# Altium project RFC_MB.PrjPcb (part 7 of 7)

## Sheet DCDC_Slow.SchDoc
size 594 x 420 mm; Address1: Address1; Address2: Address2; Address3: Address3; Address4: Address4; SheetNumber: 1; Scale: 1:1; Разраб.: Иванов; Обозначение документа: АБВГ.123456.001 Э3; Пров.: Петров; Утв.: Сидоров; Наименование организации: ОАО "Концерн "МПО-Гидроприбор"; Перв. применение: АБВГ.123456.000; Наименование изделия 1: Плата; Наименование изделия 2: Схема электрическая; Наименование изделия 3: принципиальная; Нач. отд.: Нач. отд.; Фамилия нач. отд.: Сидоров
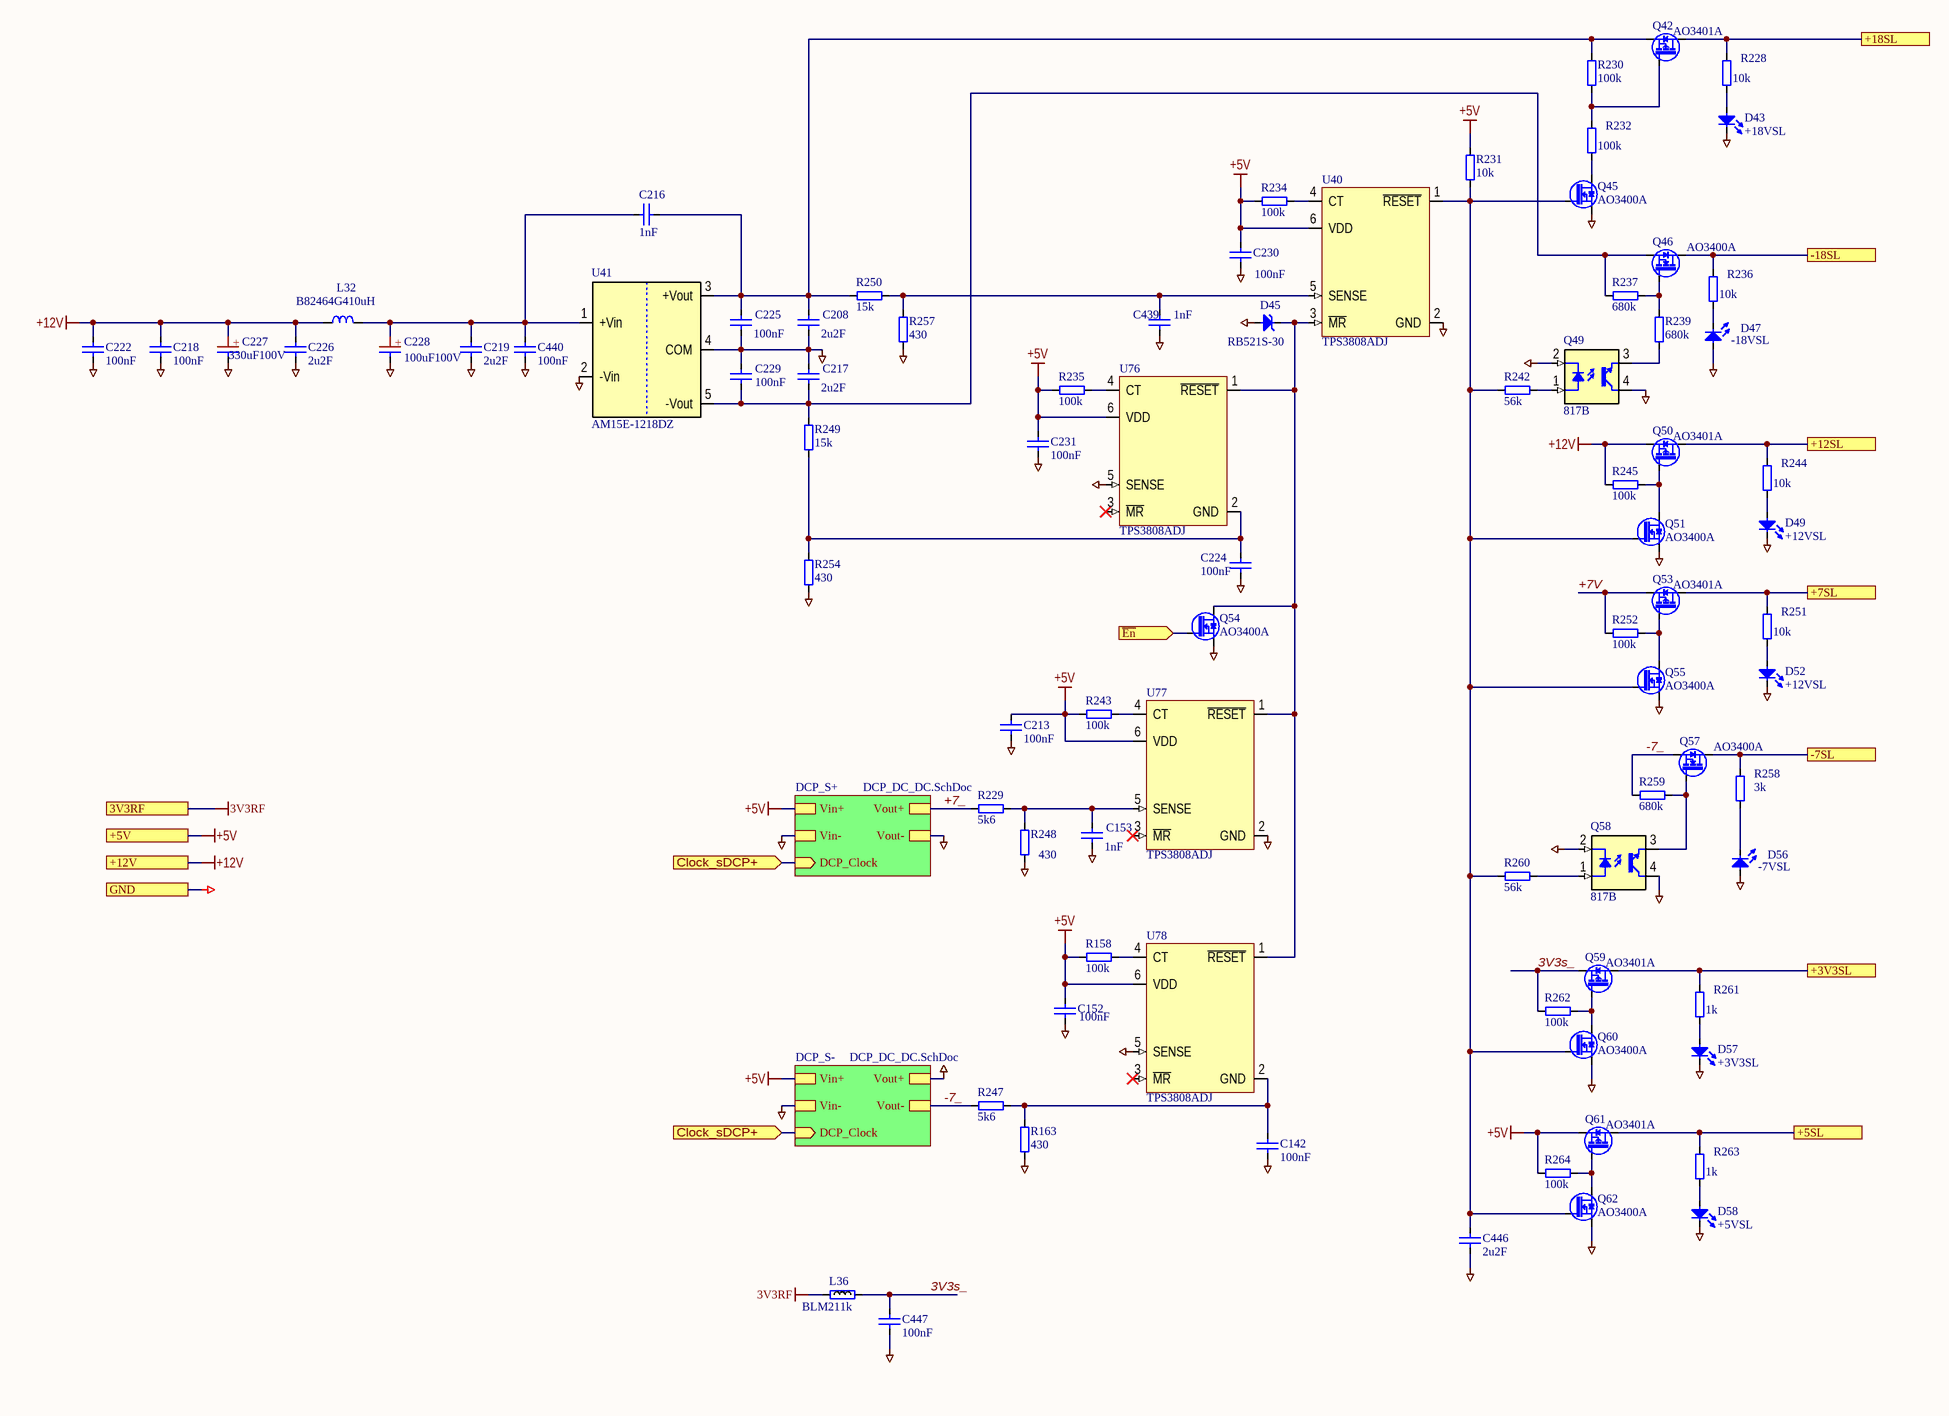
[diagram p22: DCDC_Slow.SchDoc]

### Parts
C142  100nF  [SMD0805CAP]
C152  100nF  [SMD0805CAP]
C153  1nF  [SMD0805CAP]
C208  2u2F  [SMD0805CAP]
C213  100nF  [SMD0805CAP]
C216  1nF  [SMD0805CAP]
C217  2u2F  [SMD0805CAP]
C218  100nF  [SMD0805CAP]
C219  2u2F  [SMD0805CAP]
C222  100nF  [SMD0805CAP]
C224  100nF  [SMD0805CAP]
C225  100nF  [SMD0805CAP]
C226  2u2F  [SMD0805CAP]
C227  330uF100V  [CAPPR750-1600X2000]
C228  100uF100V  [CAPPR500-1000X1250]
C229  100nF  [SMD0805CAP]
C230  100nF  [SMD0805CAP]
C231  100nF  [SMD0805CAP]
C439  1nF  [SMD0805CAP]
C440  100nF  [SMD0805CAP]
C446  2u2F  [SMD0805CAP]
C447  100nF  [SMD0805CAP]
D43  +18VSL  [LED0603]
D45  RB521S-30  [SODFL1608X65N]
D47  -18VSL  [LED0603]
D49  +12VSL  [LED0603]
D52  +12VSL  [LED0603]
D56  -7VSL  [LED0603]
D57  +3V3SL  [LED0603]
D58  +5VSL  [LED0603]
L32  B82464G410uH  [IND_COILCRAFT_MSS1038]
L36  BLM211k  [RESC2012X50N]
Q42  AO3401A  [SOT95P229X119-3N]
Q45  AO3400A  [SOT95P229X119-3N]
Q46  AO3400A  [SOT95P229X119-3N]
Q49  817B  [DIP4-300]
Q50  AO3401A  [SOT95P229X119-3N]
Q51  AO3400A  [SOT95P229X119-3N]
Q53  AO3401A  [SOT95P229X119-3N]
Q54  AO3400A  [SOT95P229X119-3N]
Q55  AO3400A  [SOT95P229X119-3N]
Q57  AO3400A  [SOT95P229X119-3N]
Q58  817B  [DIP4-300]
Q59  AO3401A  [SOT95P229X119-3N]
Q60  AO3400A  [SOT95P229X119-3N]
Q61  AO3401A  [SOT95P229X119-3N]
Q62  AO3400A  [SOT95P229X119-3N]
R158  100k  [SMD0805RES]
R163  430  [SMD0805RES]
R228  10k  [SMD0805RES]
R229  5k6  [SMD0805RES]
R230  100k  [SMD0805RES]
R231  10k  [SMD0805RES]
R232  100k  [SMD0805RES]
R234  100k  [SMD0805RES]
R235  100k  [SMD0805RES]
R236  10k  [SMD0805RES]
R237  680k  [SMD0805RES]
R239  680k  [SMD0805RES]
R242  56k  [SMD0805RES]
R243  100k  [SMD0805RES]
R244  10k  [SMD0805RES]
R245  100k  [SMD0805RES]
R247  5k6  [SMD0805RES]
R248  430  [SMD0805RES]
R249  15k  [SMD0805RES]
R250  15k  [SMD0805RES]
R251  10k  [SMD0805RES]
R252  100k  [SMD0805RES]
R254  430  [SMD0805RES]
R257  430  [SMD0805RES]
R258  3k  [SMD0805RES]
R259  680k  [SMD0805RES]
R260  56k  [SMD0805RES]
R261  1k  [SMD0805RES]
R262  100k  [SMD0805RES]
R263  1k  [SMD0805RES]
R264  100k  [SMD0805RES]
U40  TPS3808ADJ  [SOT95P270X145-6N]
U41  AM15E-1218DZ  [AM15E]
U76  TPS3808ADJ  [SOT95P270X145-6N]
U77  TPS3808ADJ  [SOT95P270X145-6N]
U78  TPS3808ADJ  [SOT95P270X145-6N]

### Sub-sheets
DCP_S+ = DCP_DC_DC.SchDoc: DCP_Clock (in), Vout+, Vout-, Vin-, Vin+
DCP_S- = DCP_DC_DC.SchDoc: DCP_Clock (in), Vout+, Vout-, Vin-, Vin+

### Ports
3V3RF, +3V3SL, +5SL, +5V, +7SL, +12SL, +12V, +18SL, -7SL, -18SL, Clock_sDCP+ (in), GND, ~{En} (in)

### Nets
3V3RF: L36.2 ; port 3V3RF
+5V: C152.2 C213.2 C230.2 C231.2 Q61.2(S) R158.1 R231.1 R234.1 R235.1 R243.1 R264.2 U40.6(VDD) U76.6(VDD) U77.6(VDD) U78.6(VDD) ; port +5V, sheet DCP_S+/Vin+, sheet DCP_S-/Vin+
+12V: C218.2 C222.2 C226.2 C227.1(+) L32.1 Q50.2(S) R245.2 ; port +12V
GND: C142.2 C152.1 C153.1 C208.1 C213.1 C217.2 C218.1 C219.1 C222.1 C224.2 C225.2 C226.1 C227.2 C228.2 C229.1 C230.1 C231.1 C439.1 C440.2 C446.2 C447.1 D43.1(C) D45.2(A) D47.2(A) D49.1(C) D52.1(C) D56.2(A) D57.1(C) D58.1(C) Q45.2(S) Q49.2(C) Q49.4(C) Q51.2(S) Q54.2(S) Q55.2(S) Q58.2(C) Q58.4(C) Q60.2(S) Q62.2(S) R163.1 R248.2 R254.1 R257.1 U40.2(GND) U41.2(-Vin) U41.4(COM) U76.5(SENSE) U77.2(GND) U78.5(SENSE) ; port GND, sheet DCP_S+/Vout-, sheet DCP_S+/Vin-, sheet DCP_S-/Vout+, sheet DCP_S-/Vin-
3V3s_: C447.2 L36.1 Q59.2(S) R262.2
3V3SL: Q59.3(D) R261.2 ; port +3V3SL
+5SL: Q61.3(D) R263.2 ; port +5SL
+7_: R229.2 ; sheet DCP_S+/Vout+
+7SL: Q53.3(D) R251.2 ; port +7SL
+7V: Q53.2(S) R252.2
+12SL: Q50.3(D) R244.2 ; port +12SL
+18SL: Q46.3(D) R236.2 ; port -18SL
-7_: Q57.2(S) R247.1 R259.2 ; sheet DCP_S-/Vout-
-7SL: Q57.3(D) R258.2 ; port -7SL
-18SL: Q42.3(D) R228.2 ; port +18SL
~{En}: Q54.1(G) ; port ~{En}
NetC142_1: C142.1 R163.2 R247.2 U78.2(GND)
NetC153_2: C153.2 R229.1 R248.1 U77.5(SENSE)
NetC208_2: C208.2 C216.2 C225.1 Q42.2(S) R230.1 R250.2 U41.3(+Vout)
NetC216_1: C216.1 C219.2 C228.1(+) C440.1 L32.2 U41.1(+Vin)
NetC217_1: C217.1 C229.2 Q46.2(S) R237.2 R249.1 U41.5(-Vout)
NetC224_1: C224.1 R249.2 R254.2 U76.2(GND)
NetC439_2: C439.2 R250.1 R257.2 U40.5(SENSE)
NetC446_1: C446.1 Q45.1(G) Q51.1(G) Q55.1(G) Q60.1(G) Q62.1(G) R231.2 R242.1 R260.1 U40.1(~{RESET})
NetD43_2: D43.2(A) R228.1
NetD45_1: D45.1(C) Q54.3(D) U40.3(~{MR}) U76.1(~{RESET}) U77.1(~{RESET}) U78.1(~{RESET})
NetD47_1: D47.1(C) R236.1
NetD49_2: D49.2(A) R244.1
NetD52_2: D52.2(A) R251.1
NetD56_1: D56.1(C) R258.1
NetD57_2: D57.2(A) R261.1
NetD58_2: D58.2(A) R263.1
NetQ22_6_1: port Clock_sDCP+, sheet DCP_S+/DCP_Clock, sheet DCP_S-/DCP_Clock
NetQ42_1: Q42.1(G) R230.2 R232.2
NetQ45_3: Q45.3(D) R232.1
NetQ46_1: Q46.1(G) R237.1 R239.2
NetQ49_1: Q49.1(A) R242.2
NetQ49_3: Q49.3(E) R239.1
NetQ50_1: Q50.1(G) Q51.3(D) R245.1
NetQ53_1: Q53.1(G) Q55.3(D) R252.1
NetQ57_1: Q57.1(G) Q58.3(E) R259.1
NetQ58_1: Q58.1(A) R260.2
NetQ59_1: Q59.1(G) Q60.3(D) R262.1
NetQ61_1: Q61.1(G) Q62.3(D) R264.1
NetR158_2: R158.2 U78.4(CT)
NetR234_2: R234.2 U40.4(CT)
NetR235_2: R235.2 U76.4(CT)
NetR243_2: R243.2 U77.4(CT)

Not connected (* = marked no-connect by the designer): U76 3(~{MR})*; U77 3(~{MR})*; U78 3(~{MR})*

### Notes on the sheet
- Подп. и дата
- Инв. № дубл.
- Взам. инв. №
- Инв. № подл.
- Изм.
- Лист
- № докум.
- Подп.
- Дата
- Копировал
- Формат А2

### Library data of the parts
C142 C152 C153 C208 C213 C216-C219 C222 C224-C226 C229-C231 C439 C440 C446 C447 = C0805: Чип конденсатор 0805; Voltage: 25V; Vendor: Vishay; DielectricType: X5R; SMD Solders: 2; Solder Option: RM; Tolerance: 20%; Pkg: SMD0805; Device: Cap0805; Price: 2
  C142 C152 C213 C218 C222 C224 C225 C229-C231 C440 C447: Value: 100nF
  C153 C216 C439: Value: 1nF
  C208 C217 C219 C226 C446: Value: 2u2F
C227 = CAP_POL_7_5x16: Конденсатор полярный d16 p7.5мм; Voltage: 100V; Vendor: Vishay; Value: 330uF; SMD Solders: 0; Solder Option: RM; Tolerance: 20%; Pkg: 7.5x16mm; Device: Cap+; THD Solders: 2; Price: 30
C228 = CAP_POL_5x10: Конденсатор полярный d10 p5мм; Voltage: 100V; Vendor: Vishay; Value: 100uF; SMD Solders: 0; Solder Option: RM; Tolerance: 20%; Pkg: 5x10mm; Device: Cap+; THD Solders: 2; Price: 20
D43 D47 D49 D52 D56-D58 = LED0603: Чип светодиод 0603; Vendor: KB; SMD Solders: 2; Solder Option: RM; Pkg: SMD0603; Price: 10; Device: LED0603
  D43: Value: +18VSL
  D47: Value: -18VSL
  D49 D52: Value: +12VSL
  D56: Value: -7VSL
  D57: Value: +3V3SL
  D58: Value: +5VSL
D45 = RB521S-30: Чип Шоттки диод; Vendor: CTK; Voltage: 30V; SMD Solders: 2; Solder Option: RM; Pkg: SOD523; Price: 5; Device: RB521S-30; Name to order: RB521S-30
L32 = B82464G4: SMD Дроссель; Vendor: Epcos; Value: 10uH; Voltage: 2; Solder Option: RM; Tolerance: 20%; Pkg: SMD10.4x10.4mm; THD Solders: 0; Name to order: B82464G4103M; Current: 3A5; Price: 400; SMD Solders: 2; Device: B82464G4
L36 = BLM21: SMD Ferrite bead 0805; Vendor: Vishay; Value: 1k; Pkg: SMD0805; SMD Solders: 2; Solder Option: RM; Price: 10; Device: BLM21
Q42 Q50 Q53 Q59 Q61 = AO3401A: PMOS; Vendor: UMW; Pkg: SOT23; SMD Solders: 3; Solder Option: RM; THD Solders: 0; Voltage: -30V; Price: 10; Device: AO3401A; Name to order: AO3401A
Q45 Q46 Q51 Q54 Q55 Q57 Q60 Q62 = AO3400A: NMOS; Vendor: UMW; Pkg: SOT23; SMD Solders: 3; Solder Option: RM; Voltage: 30V; Price: 10; Device: AO3400A; Name to order: AO3400A
Q49 Q58 = 817B: Optotransistor; Pkg: DIP4; SMD Solders: 0; Solder Option: RM; THD Solders: 4; Vendor: UMW; Voltage: 35V; Device: 817B; Price: 10; Name to order: 817B; Current: 0
R158 R163 R228-R232 R234-R237 R239 R242-R245 R247-R252 R254 R257-R264 = R0805: Чип резистор 0805; Vendor: Vishay; SMD Solders: 2; Solder Option: RM; TC: 100ppm/C; Tolerance: 1%; Pkg: SMD0805; Pwr: 125mW; Device: Res0805; Price: 2
  R158 R230 R232 R234 R235 R243 R245 R252 R262 R264: Value: 100k
  R163 R248 R254 R257: Value: 430
  R228 R231 R236 R244 R251: Value: 10k
  R229 R247: Value: 5k6
  R237 R239 R259: Value: 680k
  R242 R260: Value: 56k
  R249 R250: Value: 15k
  R258: Value: 3k
  R261 R263: Value: 1k
U40 U76-U78 = TPS3808: Supervisory Circuit. Low-Quiescent-Current, Programmable-Delay; Vendor: Texas Instruments; Value: ADJ; Pkg: SOT23-6; SMD Solders: 6; Solder Option: RM; THD Solders: 0; Name to order: TPS3808G01DBV; Current: 6uA; thVoltage: 400mV; Price: 200; Device: TPS3808
U41 = AM15E-: Negative LDO Linear stabilizer; Vendor: Aimtec; Value: 1218DZ; Pkg: DCDC_5; SMD Solders: 0; Solder Option: RM; THD Solders: 5; Name to order: AM15-1218DZ; Price: 2000; Device: AM15E-

## Sheet Si5395_CLK_GEN.SchDoc
size 594 x 420 mm
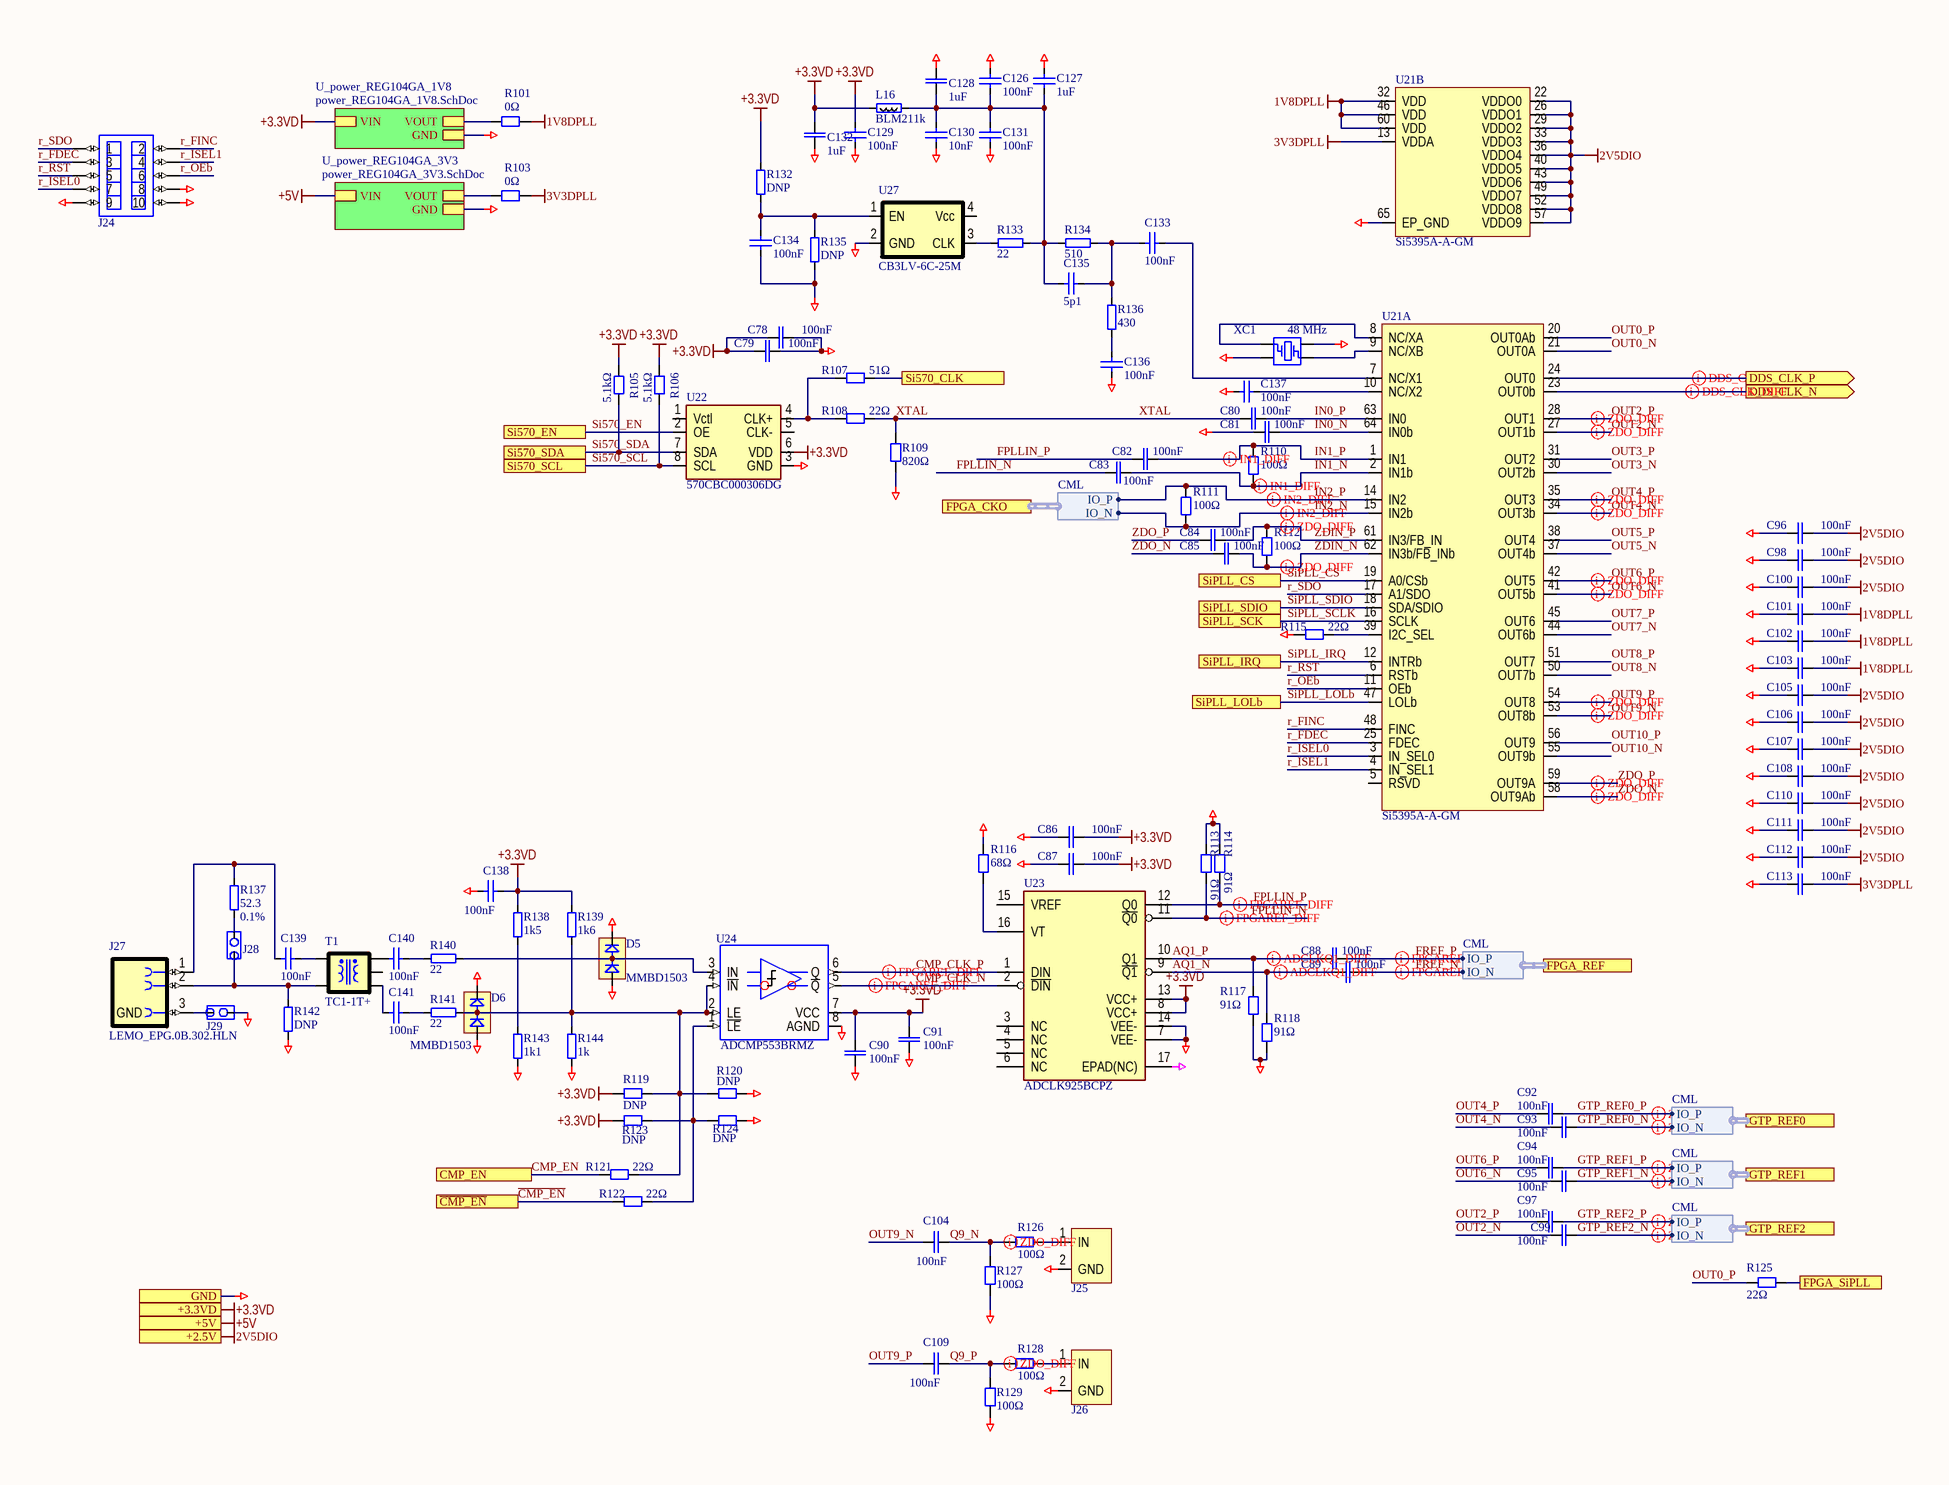
[diagram p23: Si5395_CLK_GEN.SchDoc]

### Parts
C78  100nF  [CAPC1608N]
C79  100nF  [CAPC1608N]
C80  100nF  [CAPC1608N]
C81  100nF  [CAPC1608N]
C82  100nF  [CAPC1608N]
C83  100nF  [CAPC1608N]
C84  100nF  [CAPC1608N]
C85  100nF  [CAPC1608N]
C86  100nF  [CAPC1608N]
C87  100nF  [CAPC1608N]
C88  100nF  [CAPC1608N]
C89  100nF  [CAPC1608N]
C90  100nF  [CAPC1608N]
C91  100nF  [CAPC1608N]
C92  100nF  [CAPC1608N]
C93  100nF  [CAPC1608N]
C94  100nF  [CAPC1608N]
C95  100nF  [CAPC1608N]
C96  100nF  [CAPC1608N]
C97  100nF  [CAPC1608N]
C98  100nF  [CAPC1608N]
C99  100nF  [CAPC1608N]
C100  100nF  [CAPC1608N]
C101  100nF  [CAPC1608N]
C102  100nF  [CAPC1608N]
C103  100nF  [CAPC1608N]
C104  100nF  [CAPC1608N]
C105  100nF  [CAPC1608N]
C106  100nF  [CAPC1608N]
C107  100nF  [CAPC1608N]
C108  100nF  [CAPC1608N]
C109  100nF  [CAPC1608N]
C110  100nF  [CAPC1608N]
C111  100nF  [CAPC1608N]
C112  100nF  [CAPC1608N]
C113  100nF  [CAPC1608N]
C126  100nF  [SMD0805CAP]
C127  1uF  [SMD0805CAP]
C128  1uF  [0508]
C129  100nF  [CAPC1608X87N]
C130  10nF  [CAPC1608X87N]
C131  100nF  [CAPC1608X87N]
C132  1uF  [0508]
C133  100nF  [CAPC1608X87N]
C134  100nF  [CAPC1608X87N]
C135  5p1  [CAPC1608X87N]
C136  100nF  [CAPC1608X87N]
C137  100nF  [CAPC1608X87N]
C138  100nF  [SMD0805CAP]
C139  100nF  [SMD0805CAP]
C140  100nF  [SMD0805CAP]
C141  100nF  [SMD0805CAP]
D5  MMBD1503  [SOT95P280X115-3N]
D6  MMBD1503  [SOT95P280X115-3N]
J24  DNP  [PLD-10]  (value not drawn)
J25  DNP  [LEMO_EPA.00.250.NTN]  (value not drawn)
J26  DNP  [LEMO_EPA.00.250.NTN]  (value not drawn)
J27  LEMO_EPG.0B.302.HLN  [LEMO_EPG.0B.302.HLN]
J28  PLS-2  [PLS-2]  (value not drawn)
J29  PLS-2  [PLS-2]  (value not drawn)
L16  BLM211k  [RESC2012X50N]
R101  0Ω  [RESC2012N]
R103  0Ω  [RESC2012N]
R105  5.1kΩ  [RESC2012N]
R106  5.1kΩ  [RESC2012N]
R107  51Ω  [RESC2012N]
R108  22Ω  [RESC1608N]
R109  820Ω  [RESC1608N]
R110  100Ω  [RESC1608N]
R111  100Ω  [RESC1608N]
R112  100Ω  [RESC1608N]
R113  91Ω  [RESC1608N]
R114  91Ω  [RESC1608N]
R115  22Ω  [RESC1608N]
R116  68Ω  [RESC1608N]
R117  91Ω  [RESC1608N]
R118  91Ω  [RESC1608N]
R119  DNP  [RESC1608N]
R120  DNP  [RESC1608N]
R121  22Ω  [RESC1608N]
R122  22Ω  [RESC1608N]
R123  DNP  [RESC1608N]
R124  DNP  [RESC1608N]
R125  22Ω  [RESC1608N]
R126  100Ω  [RESC1608N]
R127  100Ω  [RESC1608N]
R128  100Ω  [RESC1608N]
R129  100Ω  [RESC1608N]
R132  DNP  [SMD0805RES]
R133  22  [SMD0805RES]
R134  510  [SMD0805RES]
R135  DNP  [SMD0805RES]
R136  430  [SMD0805RES]
R137  52.3  Tolerance: 0.1%  [SMD0805RES]
R138  1k5  [SMD0805RES]
R139  1k6  [SMD0805RES]
R140  22  [SMD0805RES]
R141  22  [SMD0805RES]
R142  DNP  [SMD0805RES]
R143  1k1  [SMD0805RES]
R144  1k  [SMD0805RES]
T1  TC1-1T+  [XFMR_MINI-CIRCUITS_AT224]
U21  Si5395A-A-GM  [QFN50P900X900X100-65N-S530]  (parts A,B of 2)
U22  570CBC000306DG  [FP-57x-MFG]
U23  ADCLK925BCPZ  [QFN50P300X300X100-17N-S150]
U24  ADCMP553BRMZ  [SOP65P490X110-8N]
U27  CB3LV-6C-25M  [OSCSC508P500X700X160-4N]
XC1  value 48 MHz  [SMD3225_4PIN_XTAL]  (hidden comment: CX3225SB48000D0WPSC1)

### Sub-sheets
U_power_REG104GA_1V8 = power_REG104GA_1V8.SchDoc: GND, VOUT, VIN
U_power_REG104GA_3V3 = power_REG104GA_3V3.SchDoc: GND, VOUT, VIN

### Ports
+2.5V, +3.3VD, +5V, CMP_EN, DDS_CLK_N (out), DDS_CLK_P (out), FPGA_CKO (harness CML), FPGA_REF (harness CML), FPGA_SiPLL, GND, GTP_REF0 (harness CML), GTP_REF1 (harness CML), GTP_REF2 (harness CML), Si570_CLK, Si570_EN, Si570_SCL, Si570_SDA, SiPLL_CS, SiPLL_IRQ, SiPLL_LOLb, SiPLL_SCK, SiPLL_SDIO, ~{CMP_EN}

### Harnesses
CML: IO_N, IO_P

### Nets
1V8DPLL: C101.2 C102.2 C103.2 R101.1 U21.32(VDD) U21.46(VDD) U21.60(VDD)
2V5DIO: C96.2 C98.2 C100.2 C105.2 C106.2 C107.2 C108.2 C110.2 C111.2 C112.2 U21.22(VDDO0) U21.26(VDDO1) U21.29(VDDO2) U21.33(VDDO3) U21.36(VDDO4) U21.40(VDDO5) U21.43(VDDO6) U21.49(VDDO7) U21.52(VDDO8) U21.57(VDDO9) ; port +2.5V  [project net +2V5MOD]
3V3DPLL: C113.2 R103.1 U21.13(VDDA)
+3.3VD: C78.1 C79.1 C86.2 C87.2 C90.1 C91.1 C129.2 C132.1 C138.1 L16.1 R105.1 R106.1 R119.1 R123.1 R132.2 R138.2 R139.2 U22.6(VDD) U23.8(VCC+) U23.13(VCC+) U24.7(VCC) ; port +3.3VD, sheet U_power_REG104GA_1V8/VIN
+5V: port +5V, sheet U_power_REG104GA_3V3/VIN  [project net +5VME]
GEPAD: U23.17(EPAD(NC))
GND: C78.2 C79.2 C81.1 C86.1 C87.1 C90.2 C91.2 C96.1 C98.1 C100.1 C101.1 C102.1 C103.1 C105.1 C106.1 C107.1 C108.1 C110.1 C111.1 C112.1 C113.1 C126.1 C127.1 C128.2 C129.1 C130.1 C131.1 C132.2 C134.1 C136.1 C137.2 C138.2 D5.1 D5.2 D6.1 D6.2 J24.8 J24.9 J24.10 J25.2(GND) J26.2(GND) J29.2 R109.2 R113.2 R114.2 R115.1 R116.2 R117.1 R118.1 R120.2 R124.2 R127.1 R129.1 R135.1 R142.1 R143.1 R144.1 U21.65(EP_GND) U22.3(GND) U23.7(VEE-) U23.14(VEE-) U24.8(AGND) U27.2(GND) XC1.2(SLD) XC1.4(SLD) ; port GND, sheet U_power_REG104GA_1V8/GND, sheet U_power_REG104GA_3V3/GND
AQ1_N: C89.1 R118.2 U23.9(~{Q1})
AQ1_P: C88.1 R117.2 U23.10(Q1)
~{CMP_EN}: R122.1 ; port ~{CMP_EN}  [project net IO_AL9]
CMP_CLK_N: U23.2(~{DIN}) U24.5(~{Q})
CMP_CLK_P: U23.1(DIN) U24.6(Q)
CMP_EN: R121.1 ; port CMP_EN  [project net IO_AL10]
DDS_CLK_N: U21.23(OUT0b) ; port DDS_CLK_N
DDS_CLK_P: U21.24(OUT0) ; port DDS_CLK_P
FPLLIN_N: C83.1 R113.1 U23.11(~{Q0})
FPLLIN_P: C82.1 R114.1 U23.12(Q0)
FREF_N: C89.2 ; port FPGA_REF.IO_N  [project net IO_CR34]
FREF_P: C88.2 ; port FPGA_REF.IO_P  [project net IO_CR33]
GTP_REF0_N: C93.2 ; port GTP_REF0.IO_N  [project net GTP_REF0.IO_N]
GTP_REF0_P: C92.2 ; port GTP_REF0.IO_P  [project net GTP_REF0.IO_P]
GTP_REF1_N: C95.2 ; port GTP_REF1.IO_N  [project net GTP_REF1.IO_N]
GTP_REF1_P: C94.2 ; port GTP_REF1.IO_P  [project net GTP_REF1.IO_P]
GTP_REF2_N: C99.2 ; port GTP_REF2.IO_N  [project net GTP_REF2.IO_N]
GTP_REF2_P: C97.2 ; port GTP_REF2.IO_P  [project net GTP_REF2.IO_P]
IN0_N: C81.2 U21.64(IN0b)
IN0_P: C80.2 U21.63(IN0)
IN1_N: C83.2 R110.1 U21.2(IN1b)
IN1_P: C82.2 R110.2 U21.1(IN1)
IN2_N: R111.1 U21.15(IN2b) ; port FPGA_CKO.IO_N
IN2_P: R111.2 U21.14(IN2) ; port FPGA_CKO.IO_P
IO_AR11: R125.2 ; port FPGA_SiPLL
IO_CLK4P_AL25: R107.2 ; port Si570_CLK
OUT0_N: U21.21(OUT0A)
OUT0_P: R125.1 U21.20(OUT0Ab)
OUT2_N: C99.1 U21.27(OUT1b)
OUT2_P: C97.1 U21.28(OUT1)
OUT3_N: U21.30(OUT2b)
OUT3_P: U21.31(OUT2)
OUT4_N: C93.1 U21.34(OUT3b)
OUT4_P: C92.1 U21.35(OUT3)
OUT5_N: U21.37(OUT4b)
OUT5_P: U21.38(OUT4)
OUT6_N: C95.1 U21.41(OUT5b)
OUT6_P: C94.1 U21.42(OUT5)
OUT7_N: U21.44(OUT6b)
OUT7_P: U21.45(OUT6)
OUT8_N: U21.50(OUT7b)
OUT8_P: U21.51(OUT7)
OUT9_N: C104.1 U21.53(OUT8b)
OUT9_P: C109.1 U21.54(OUT8)
OUT10_N: U21.55(OUT9b)
OUT10_P: U21.56(OUT9)
Q9_N: C104.2 R126.1 R127.2
Q9_P: C109.2 R128.1 R129.2
r_FDEC: J24.3 U21.25(FDEC)
r_FINC: J24.2 U21.48(FINC)
r_ISEL0: J24.7 U21.3(IN_SEL0)
r_ISEL1: J24.4 U21.4(IN_SEL1)
r_OEb: J24.6 U21.11(OEb)
r_RST: J24.5 U21.6(RSTb)
r_SDO: J24.1 U21.17(A1/SDO)
Si570_EN: U22.2(OE) ; port Si570_EN  [project net IO_AL8]
Si570_SCL: R106.2 U22.8(SCL) ; port Si570_SCL  [project net IO_AL7]
Si570_SDA: R105.2 U22.7(SDA) ; port Si570_SDA  [project net IO_AL5]
SiPLL_CS: U21.19(A0/CSb) ; port SiPLL_CS  [project net IO_AL4]
SiPLL_IRQ: U21.12(INTRb) ; port SiPLL_IRQ  [project net IO_AL1]
SiPLL_LOLb: U21.47(LOLb) ; port SiPLL_LOLb  [project net IO_AL6]
SiPLL_SCLK: U21.16(SCLK) ; port SiPLL_SCK  [project net IO_AL3]
SiPLL_SDIO: U21.18(SDA/SDIO) ; port SiPLL_SDIO  [project net IO_AL2]
XTAL: C80.1 R108.2 R109.1
ZDIN_N: C85.2 R112.1 U21.62(IN3b/FB_INb)
ZDIN_P: C84.2 R112.2 U21.61(IN3/FB_IN)
ZDO_N: C85.1 U21.58(OUT9Ab)
ZDO_P: C84.1 U21.59(OUT9A)
NetC114_1: R103.2 ; sheet U_power_REG104GA_3V3/VOUT
NetC120_1: R101.2 ; sheet U_power_REG104GA_1V8/VOUT
NetC126_2: C126.2 C127.2 C128.1 C130.2 C131.2 C135.2 L16.2 R133.1 R134.2
NetC133_1: C133.1 U21.7(NC/X1)
NetC133_2: C133.2 C135.1 R134.1 R136.1
NetC134_2: C134.2 R132.1 R135.2 U27.1(EN)
NetC136_2: C136.2 R136.2
NetC137_1: C137.1 U21.10(NC/X2)
NetC139_1: C139.1 J27.1 R137.2
NetC139_2: C139.2 T1.4
NetC140_1: C140.1 T1.3
NetC140_2: C140.2 R140.2
NetC141_1: C141.1 T1.1
NetC141_2: C141.2 R141.2
NetD5_3: D5.3 R140.1 U24.3(IN)
NetD6_3: D6.3 R119.2 R120.1 R121.2 R139.1 R141.1 R144.2 U24.2(LE) U24.4(~{IN})
NetJ25_1: J25.1(IN) R126.2
NetJ26_1: J26.1(IN) R128.2
NetJ27_2: J27.2 J28.1 R142.2 T1.6
NetJ27_3: J27.3(GND) J29.1
NetJ28_2: J28.2 R137.1
NetR107_1: R107.1 R108.1 U22.4(CLK+)
NetR115_2: R115.2 U21.39(I2C_SEL)
NetR116_1: R116.1 U23.16(VT)
NetR122_2: R122.2 R123.2 R124.1 U24.1(~{LE})
NetR133_2: R133.2 U27.3(CLK)
NetR138_1: R138.1 R143.2
NetU21_8: U21.8(NC/XA) XC1.1(XTAL+)
NetU21_9: U21.9(NC/XB) XC1.3(XTAL-)

Not connected (* = marked no-connect by the designer): T1 2; U21 5(RSVD); U22 1(Vctl) 5(CLK-); U23 3(NC) 4(NC) 5(NC) 6(NC) 15(VREF); U27 4(Vcc)

### Layout directives
differential pair; rule Differential Pairs Routing [Pref Gap = 0.175mm    Min Gap  = 0.075mm    Max Gap  = 0.5mmPref Width = 0.15mm    Min Width  = 0.075mm    Max Width  = 0.5mm]: IN1_N, IN1_P, IN2_N, IN2_P, OUT2_N, OUT2_P, OUT4_N, OUT4_P, OUT6_N, OUT6_P, OUT9_N, OUT9_P, Q9_N, Q9_P, ZDIN_N, ZDIN_P, ZDO_N, ZDO_P
differential pair; rule Differential Pairs Routing [Pref Gap = 0.175mm    Min Gap  = 0.075mm    Max Gap  = 0.5mmPref Width = 0.25mm    Min Width  = 0.075mm    Max Width  = 0.5mm]: AQ1_N, AQ1_P, CMP_CLK_N, CMP_CLK_P, DDS_CLK_N, DDS_CLK_P, FPLLIN_N, FPLLIN_P, IO_CR33, IO_CR34
differential pair; rule Differential Pairs Routing [Pref Gap = 0.4mm    Min Gap  = 0.075mm    Max Gap  = 0.5mmPref Width = 0.3mm    Min Width  = 0.075mm    Max Width  = 0.5mm]: GTP_REF0.IO_N, GTP_REF0.IO_P, GTP_REF1.IO_N, GTP_REF1.IO_P, GTP_REF2.IO_N, GTP_REF2.IO_P

### Notes on the sheet
- Подп. и дата
- Инв. № дубл.
- Взам. инв. №
- Инв. № подл.
- Изм.
- Лист
- № докум.
- Подп.
- Дата
- Копировал
- Формат А2

### Library data of the parts
C78-C113 = CAPC: Generic ceramic SMD capacitor; Pkg: 0603; Maintainer: Evgeniy Kotov; SMD Solders: 2; THD Solders: 0; PartField: 100nF; Last Change Data: 06.03.2017; Release Date: 06.03.2017; Value: 100nF
C126 C127 = C0805: as C142 on sheet DCDC_Slow; Price: 2
  C126: Value: 100nF
  C127: Value: 1uF
C128 C132 = CAP_LLL219R71A105: 1uF; 10V; 0805R; X7R; Low ESL; Reverse geometry; Vendor: muRata; SolderOption: 2; THD Solders: 0; PartField: LLL219R71A105; Pkg: 0508; Value: 1uF; SMD Solders: 2; ClassName: Soldered_BINP
C129-C131 C133-C137 = C0603: Чип конденсатор 0603; Voltage: 50V; Vendor: Vishay; DielectricType: X5R; SMD Solders: 2; Solder Option: RM; Tolerance: 20%; Pkg: SMD0603; Device: Cap603; Price: 2
  C129 C131 C133 C134 C136 C137: Value: 100nF
  C130: Value: 10nF
  C135: Value: 5p1
C138-C141 = C0805: Чип конденсатор 0805; Voltage: 50V; Vendor: Vishay; DielectricType: X5R; SMD Solders: 2; Solder Option: RM; Tolerance: 20%; Pkg: SMD0805; Device: Cap0805; Value: 100nF; Price: 2
D5 D6 = MMBD1503: High Conductance Low Leakage Diode; SolderOption: 0; Pkg: SOT-3N; SMD Solders: 3; HelpURL: https://www.engineering.uiowa.edu/sites/default/files/ees/files/NI/pdfs/01/30/DS013013.pdf; Value: MMBD1503; PartField: MMBD1503; THD Solders: 0
J24 = IDC-10MS: Connector, 5x2, Male, 2.54mm Pitch, Strait contacts, with Body; PartField: IDC-10MC; SMD Solders: 0; THD Solders: 10; Maintainer: Evgeniy Kotov; Pkg: IDC-10; Last Change Data: 28.03.2017; Release Date: 28.03.2017; Value: DNP; ComponentLink1Description: Datasheet
J25 J26 = LEMO_EPA.00.250: PartField: EPA.00.250.NTN; SolderOption: 0; Pkg: LEMO 5pin; THD Solders: 5; Value: DNP; SMD Solders: 0
J27 = LEMO_EPG.0B.302.HLN: LEMO дифференциальный, угдовой; SMD Solders: 0; Solder Option: RM; THD Solders: 6; Price: 5000; Vendor: LEMO; Pkg: LEMO_EPG.0B.302.HLN; Device: LEMO_EPG.0B.302.HLN; Name to order: LEMO_EPG.0B.302.HLN
J28 J29 = PLS-2: Connector, 5x2, Male, 2.54mm Pitch, Right Angle; SMD Solders: 0; THD Solders: 2; Maintainer: Evgeniy Kotov; PartField: PLS-2; Last Change Data: 02.04.2017; Release Date: 02.04.2017; Value: PLS-2; ComponentLink1Description: Datasheet; Pkg: PLS-2
L16 = BLM21: as L36 on sheet DCDC_Slow; Price: 10; Device: BLM21
R101 R103 R105-R107 = RESC: Resistor, Generic, SMD; Pkg: 0805; Maintainer: Evgeniy Kotov; SMD Solders: 2; THD Solders: 0; Release Date: 06.03.2017; Last Change Data: 09.03.2017
  R101 R103: PartField: 0Ω; Value: 0Ω
  R105 R106: PartField: 5.1kΩ; Value: 5.1kΩ
  R107: PartField: 51Ω; Value: 51Ω
R108-R118 R121 R122 R125-R129 = RESC: Resistor, Generic, SMD; Pkg: 0603; Maintainer: Evgeniy Kotov; SMD Solders: 2; THD Solders: 0; Release Date: 06.03.2017; Last Change Data: 09.03.2017
  R108 R115 R121 R122 R125: PartField: 22Ω; Value: 22Ω
  R109: PartField: 820Ω; Value: 820Ω
  R110-R112 R126-R129: PartField: 100Ω; Value: 100Ω
  R113 R114 R117 R118: PartField: 91Ω; Value: 91Ω
  R116: PartField: 68Ω; Value: 68Ω
R119 R120 R123 R124 = RESC: Resistor, Generic, SMD; PartField: *Ω; Pkg: 0603; Maintainer: Evgeniy Kotov; SMD Solders: 2; THD Solders: 0; Release Date: 06.03.2017; Last Change Data: 09.03.2017; Value: DNP
R132 R135 R138 R139 R142-R144 = R0805: Чип резистор 0805; Vendor: Vishay; SMD Solders: 2; Solder Option: i; TC: 100ppm/C; Tolerance: 1%; Pkg: SMD0805; Pwr: 125mW; Device: Res0805; Price: 2
  R132 R135 R142: Value: DNP
  R138: Value: 1k5
  R139: Value: 1k6
  R143: Value: 1k1
  R144: Value: 1k
R133 R134 R136 R140 R141 = R0805: as R158 on sheet DCDC_Slow; Price: 2
  R133 R140 R141: Value: 22
  R134: Value: 510
  R136: Value: 430
R137 = R0805: Чип резистор 0805; Vendor: Vishay; SMD Solders: 2; Solder Option: RM; TC: 100ppm/C; Pkg: SMD0805; Pwr: 125mW; Device: Res0805; Price: 2; Value: 52.3
T1 = TC1-1T+: RF Transformer; 50Ω; 1.5 to 500 MHz; Impedance Ratio=1; Vendor: Texas Instruments; Value: 1:1; Pkg: AT1521; SMD Solders: 5; Solder Option: RM; THD Solders: 0; Price: 1000; Device: TC1-1T+; Name to order: TC1-1T+
U21 = Si5395A: Manufacturer: SiLabs; SMD Solders: 65; THD Solders: 0; Pkg: QFN-64EP; PartField: Si5395A-A-GM; Value: Si5395A; Vendor: SiLabs
U22 = Si570: XTAL OSCILLATOR SMD; Manufacturer: Silicon Labs; Manufacturer Part Number: 541AAA001040BAGR; Min Supply Voltage: 2.375V; Max Supply Voltage: 3.465V; Pkg: SMD 6pin; Frequency: 0.2-1500MHz; Nominal Supply Current: 100mA; Maintainer: Evgeniy Kotov; SMD Solders: 6; THD Solders: 0; Value: Si570; Device Class L2: Clock and Timing; ComponentLink2Description: Datasheet; RoHS: TRUE; Device Class L1: Integrated Circuits (ICs); Height: 1.33mm; Octopart: https://octopart.com/541aaa001040bagr-silicon+labs-103392146; ComponentLink2URL: https://www.silabs.com/documents/public/data-sheets/si541-datasheet.pdf; Temperature Range High: +85°C; Category: IC; Ambient Temperature Range High: +85°C; Digikey Description: XTAL OSCILLATOR SMD; Lead Free: Yes; Ambient Temperature Range Low: -40°C; Device Class L3: Timers and Oscillators; Automotive: No; Temperature: -40°C to +85°C; Temperature Range Low: -40°C; Last Change Data: 09.03.2017; PartField: 570CBC000306DG
U23 = ADCLK925BCPZ: IC CLK FANOUT BUFFER 1:2 16LFCSP; Manufacturer: Silicon Labs; Number Of Inputs: 2; Standoff Height: 0mm; Number Of Outputs: 4; Pkg: LFCSP-16EP; Max Junction Temp: +125°C; Min Supply Voltage: 1.71V; Number Of Elements: 1; Nominal Supply Current: 65mA; Max Supply Voltage: 3.63V; Logic Function: Non-Inverting; Propagation Delay: 875ps; Maintainer: Evgeniy Kotov; SMD Solders: 17; THD Solders: 0; Manufacturer Part Number: ADCLK925BCPZ; Ambient Temperature Range High: +85°C; Device Class L2: Clock and Timing; Temperature: -40°C to +85°C; Automotive: No; Height: 0.9mm; ComponentLink2URL: https://www.silabs.com/documents/public/data-sheets/si5330x-datasheet.pdf; ComponentLink2Description: Datasheet; Temperature Range High: +85°C; Category: IC; Ambient Temperature Range Low: -40°C; Device Class L1: Integrated Circuits (ICs); Octopart: https://octopart.com/si53307-b-gm-silicon+labs-51374320; Mouser Description: Clock Buffer 1:2 Univ bufr/Lvl Trans 725MHz; Temperature Range Low: -40°C; Device Class L3: Clock Buffers; Ipc Land Pattern Name: QFN50P300X300X85-16; RoHS: TRUE; Digikey Description: IC CLK BUFFER 2:4 725MHZ 16QFN; Lead Free: Yes; PartField: ADCLK925BCPZ; Last Change Data: 09.03.2017; Value: ADCLK925BCPZ
U24 = ADCMP553BRMZ: LVDS Comparator; Vendor: Analog Devices Inc; SolderOption: 0; Pkg: MSOP-8; SMD Solders: 8; Manufacturer_Part_Number: ADCMP553BRMZ; Value: ADCMP553BRMZ; PartField: ADCMP553BRMZ; THD Solders: 0
U27 = CB3LV: Clock generator; Vendor: CTS Electronic Components; Pkg: 7x5mm; SMD Solders: 4; Solder Option: RM; THD Solders: 0; Current: 60; Value: -6C-25M; Price: 1000; Device: CB3LV; Name to order: CB3LV-6C-25M
XC1 = XTAL_CX3225SB48: Kyocera XTAL 48MHz CX3225SB48000D0WPSC1; Pkg: 4 pin SMD; Maintainer: Evgeniy Kotov; SMD Solders: 4; THD Solders: 0; PartField: CX3225SB48000D0WPSC1; Vendor: Kyocera; Release Date: 06.03.2017; Last Change Data: 09.03.2017

## Sheet power_REG104GA_1V8.SchDoc
size A4
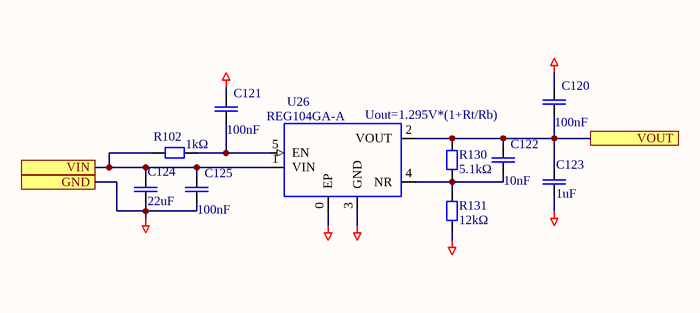
[diagram p24: power_REG104GA_1V8.SchDoc]

### Parts
C120  100nF  [CAPC1608N]
C121  100nF  [CAPC1608N]
C122  10nF  [CAPC1608N]
C123  1uF  [CAPC2012N]
C124  22uF  [CAPC2012N]
C125  100nF  [CAPC1608N]
R102  1kΩ  [RESC2012N]
R130  5.1kΩ  [RESC2012N]
R131  12kΩ  [RESC2012N]
U26  REG104GA-A  [SOT223]

### Ports
GND, VIN, VOUT

### Nets
+3.3VD: C124.2 C125.2 R102.2 U26.1(VIN) ; port VIN
GND: C120.2 C121.2 C123.1 C124.1 C125.1 R131.1 U26.0(EP) U26.3(GND) ; port GND
NetC120_1: C120.1 C122.2 C123.2 R130.2 U26.2(VOUT) ; port VOUT
NetC121_1: C121.1 R102.1 U26.5(EN)
NetC122_1: C122.1 R130.1 R131.2 U26.4(NR)

### Notes on the sheet
- (near U26) Uout=1.295V*(1+Rt/Rb)

### Library data of the parts
C120-C122 C125 = CAPC: as C78-C113 on sheet Si5395_CLK_GEN; Last Change Data: 06.03.2017; Release Date: 06.03.2017
  C120 C121 C125: PartField: 100nF; Value: 100nF
  C122: PartField: 10nF; Value: 10nF
C123 C124 = CAPC: Generic ceramic SMD capacitor; Pkg: 0805; Maintainer: Evgeniy Kotov; SMD Solders: 2; THD Solders: 0; Voltage Rating: 10V; Last Change Data: 06.03.2017; Release Date: 06.03.2017
  C123: PartField: 1uF; Value: 1uF
  C124: PartField: 22uF; Value: 22uF
R102 = RESC: Resistor, Generic, SMD; PartField: 150Ω; Pkg: 0805; Maintainer: Evgeniy Kotov; SMD Solders: 2; THD Solders: 0; Release Date: 06.03.2017; Last Change Data: 09.03.2017; Value: 1kΩ
R130 R131 = RESC: as R101 on sheet Si5395_CLK_GEN; Release Date: 06.03.2017; Last Change Data: 09.03.2017
  R130: PartField: 5.1kΩ; Value: 5.1kΩ
  R131: PartField: 12kΩ; Value: 12kΩ
U26 = REG104GA-A: Single Output LDO, 1.0A, Adj.(1.295 to 5.5V), Low Noise, Fast Transient Response; Manufacturer: Texas Instruments; Manufacturer_Part_Number: reg104-a_dcq_6; INDUSTRY_STD_PKG_TYPE: SOT-223; FAMILY_NAME: SINGLE CHANNEL LDO; PIN_COUNT: 6; PACKAGE_DESIGNATOR: DCQ; Pkg: SOT-5EP; THD Solders: 0; Value: REG104GA-A; Datasheet URL: http://www.ti.com/lit/gpn/REG104-A; GENERIC_PART_NUMBER: REG104GA-A; Vendor: Texas Instruments; SMD Solders: 6; PartField: REG104GA-A

## Sheet power_REG104GA_3V3.SchDoc
size A4
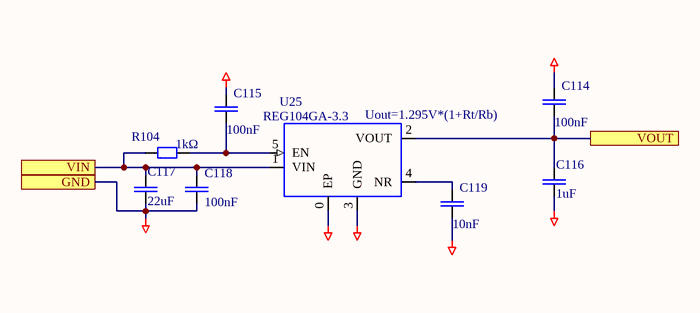
[diagram p25: power_REG104GA_3V3.SchDoc]

### Parts
C114  100nF  [CAPC1608N]
C115  100nF  [CAPC1608N]
C116  1uF  [CAPC2012N]
C117  22uF  [CAPC2012N]
C118  100nF  [CAPC1608N]
C119  10nF  [CAPC1608N]
R104  1kΩ  [RESC2012N]
U25  REG104GA-3.3  [SOT223]

### Ports
GND, VIN, VOUT

### Nets
+5VME: C117.2 C118.2 R104.2 U25.1(VIN) ; port VIN
GND: C114.2 C115.2 C116.1 C117.1 C118.1 C119.1 U25.0(EP) U25.3(GND) ; port GND
NetC114_1: C114.1 C116.2 U25.2(VOUT) ; port VOUT
NetC115_1: C115.1 R104.1 U25.5(EN)
NetC119_2: C119.2 U25.4(NR)

### Notes on the sheet
- (near U25) Uout=1.295V*(1+Rt/Rb)

### Library data of the parts
C114 C115 C118 C119 = CAPC: as C78-C113 on sheet Si5395_CLK_GEN; Last Change Data: 06.03.2017; Release Date: 06.03.2017
  C114 C115 C118: PartField: 100nF; Value: 100nF
  C119: PartField: 10nF; Value: 10nF
C116 C117 = CAPC: as C123 on sheet power_REG104GA_1V8; Last Change Data: 06.03.2017; Release Date: 06.03.2017
  C116: PartField: 1uF; Value: 1uF
  C117: PartField: 22uF; Value: 22uF
R104 = RESC: as R102 on sheet power_REG104GA_1V8; Release Date: 06.03.2017; Last Change Data: 09.03.2017; Value: 1kΩ
U25 = REG104GA-3.3: Single Output LDO, 1.0A, Fixed (3.3V), Low Noise, Fast Transient Response; Manufacturer: Texas Instruments; Manufacturer_Part_Number: reg104-33_dcq_6; INDUSTRY_STD_PKG_TYPE: SOT-223; FAMILY_NAME: SINGLE CHANNEL LDO; PIN_COUNT: 6; PACKAGE_DESIGNATOR: DCQ; Pkg: SOT-5EP; THD Solders: 0; Value: REG104GA-3.3; Datasheet URL: http://www.ti.com/lit/gpn/REG104-A; GENERIC_PART_NUMBER: REG104GA-3.3; Vendor: Texas Instruments; SMD Solders: 6; PartField: REG104GA-3.3

## Sheet Si5395_CLK_PWR.SchDoc
size A4

## Nets that join several sheets
3V3RF: RFCtl (C151.2 L80.2 R407.1 U60.14), DCDC_Hall (L25.2), Integrator (15 pins), DCDC_DDS (L21.2), DCDC_Slow (L36.2)
+1V8MOD: main (TP14.1), cyc_v_som_B (J14.B52 J14.B76 J14.B108 J14.B128)
+2V5MOD: main (TP13.1), cyc_v_som_A (J14.A53 J14.A62 J14.A65 J14.A89), cyc_v_som_B (6 pins), cyc_v_som_C (6 pins), Si5395_CLK_GEN (20 pins)
+3.3VD: main (39 pins), cyc_v_som_A (J14.A38 J14.A41 J14.A74 J14.A77), ethernet_1gbe_ext_magn (R90.1 R92.1), ethernet_dual_100mbe_ext_magn (R79.1 R85.1), uart_adm3222 (C38.2 R51.2 U10.19), jtag (7 pins), sdcard_emmc (44 pins), U_can_phy (C66_1.2 U18_1.1), U_can_phy (C66_2.2 U18_2.1), U_SFPplusConn_0 (11 pins), U_SFPplusConn_1 (11 pins), U_SFPplusConn_2 (11 pins), U_SFPplusConn_3 (11 pins), Si5395_CLK_GEN (21 pins), power_REG104GA_1V8 (C124.2 C125.2 R102.2 U26.1)
+3V3MOD: main (C15.2 TP12.1 U6.14), cyc_v_som_A (J14.A26 J14.A29 J14.A50 J14.A86), cyc_v_som_B (6 pins), cyc_v_som_C (J14.C96 J14.C103 J14.C136 J14.C143)
+5V: RFCtl (22 pins), DCDC_Hall (10 pins), RF/RF_H/H_DCDC/DCP_H- (C206_1.2 L29_1.1 R233_1.1 R241_1.1), RF/RF_i/i_DCDC/DCP_i- (C206_2.2 L29_2.1 R233_2.1 R241_2.1), RF/RF_i/i_DCDC/DCP_i+ (C206_3.2 L29_3.1 R233_3.1 R241_3.1), DCDC_DDS (7 pins), RF/RF_D/D_DCDC/DCP_D+ (C206_4.2 L29_4.1 R233_4.1 R241_4.1), RF/RF_D/D_DCDC/DCP_D- (C206_5.2 L29_5.1 R233_5.1 R241_5.1), DCDC_Slow (15 pins), RF/RF_S/S_DCDC/DCP_S+ (C206_6.2 L29_6.1 R233_6.1 R241_6.1), RF/RF_S/S_DCDC/DCP_S- (C206_7.2 L29_7.1 R233_7.1 R241_7.1)
+5VME: cyc_v_som_A (10 pins), U_can_phy (C69_1.2 C70_1.2 U19_1.1), U_can_phy (C69_2.2 C70_2.2 U19_2.1), power_REG104GA_3V3 (C117.2 C118.2 R104.2 U25.1)
+12V: DCDC_Hall (7 pins), DCDC_int (5 pins), DCDC_DDS (Q3.2 R162.2), DCDC_Slow (7 pins)
GND: main (84 pins), cyc_v_som_A (29 pins), cyc_v_som_B (37 pins), cyc_v_som_C (41 pins), ethernet_1gbe_ext_magn (7 pins), ethernet_dual_100mbe_ext_magn (7 pins), uart_adm3222 (7 pins), jtag (C33.1 J15.10 R43.2 U9.2), sdcard_emmc (33 pins), U_can_phy (5 pins), U_can_phy (5 pins), Power_3V3_LDO (C71.1 C72.1 U20.2), U_SFPplusConn_0 (31 pins), U_SFPplusConn_1 (31 pins), U_SFPplusConn_2 (31 pins), U_SFPplusConn_3 (31 pins), RFCtl (44 pins), Hall (62 pins), DCDC_Hall (41 pins), RF/RF_H/H_DCDC/DCP_H- (12 pins), Integrator (17 pins), DCDC_int (9 pins), RF/RF_i/i_DCDC/DCP_i- (9 pins), RF/RF_i/i_DCDC/DCP_i+ (9 pins), DDS (78 pins), DCDC_DDS (21 pins), RF/RF_D/D_DCDC/DCP_D+ (12 pins), RF/RF_D/D_DCDC/DCP_D- (12 pins), SlowChans (227 pins), DCDC_Slow (49 pins), RF/RF_S/S_DCDC/DCP_S+ (12 pins), RF/RF_S/S_DCDC/DCP_S- (12 pins), Si5395_CLK_GEN (65 pins), power_REG104GA_1V8 (8 pins), power_REG104GA_3V3 (8 pins)
intG: Integrator (33 pins), DCDC_int (35 pins), RF/RF_i/i_DCDC/DCP_i- (C209_2.2 C215_2.2 U38_2.13), RF/RF_i/i_DCDC/DCP_i+ (C209_3.2 C215_3.2 U38_3.13)
MGND: main (8 pins), ethernet_1gbe_ext_magn (C58.1 C59.1 J18.S1 J18.S2), ethernet_dual_100mbe_ext_magn (C51.2 C56.1 J17.S1 J17.S2), uart_adm3222 (J16.0)
VBUT: main (C7.2 R8.1), cyc_v_som_A (J14.A168)
3V3BATLDO: main (D1.1), Power_3V3_LDO (C72.2 R98.2 U20.5)
3V3DDS: DDS (25 pins), DCDC_DDS (Q10.3 R164.2)
3V3SL: SlowChans (108 pins), DCDC_Slow (Q59.3 R261.2)
12DDS: DDS (L22.2), DCDC_DDS (Q3.3 R154.2)
+3V3Hall: Hall (28 pins), DCDC_Hall (Q25.3 R193.2)
+5SL: SlowChans (L68.2 L76.2 L85.2 L93.1), DCDC_Slow (Q61.3 R263.2)
+7_: DCDC_Slow (R229.2), RF/RF_S/S_DCDC/DCP_S+ (C209_6.2 C215_6.2 U38_6.13)
+7D: DCDC_DDS (Q1.2 R147.2 R152.1), RF/RF_D/D_DCDC/DCP_D+ (C209_4.2 C215_4.2 U38_4.13)
+7DDS: DDS (L24.2), DCDC_DDS (Q1.3 R146.2)
+7H: DCDC_int (R218.2), RF/RF_i/i_DCDC/DCP_i+ (C209_3.1 C215_3.1 U38_3.12)
+7int: Integrator (L37.2), DCDC_int (Q37.3 R217.2)
+7SL: SlowChans (L71.2 L79.2 L88.2 L96.2), DCDC_Slow (Q53.3 R251.2)
+12Hall: Hall (L28.2), DCDC_Hall (Q18.3 R178.2)
+12SL: SlowChans (L69.2 L77.2 L86.2 L94.1), DCDC_Slow (Q50.3 R244.2)
+18Hall: Hall (L34.2), DCDC_Hall (Q12.3 R166.2)
+18int: Integrator (L39.2), DCDC_int (Q29.3 R199.2)
+18SL: SlowChans (L73.2 L82.2 L90.2 L98.2), DCDC_Slow (Q46.3 R236.2)
-7_: DCDC_Slow (Q57.2 R247.1 R259.2), RF/RF_S/S_DCDC/DCP_S- (C209_7.1 C215_7.1 U38_7.12)
-7D: DCDC_DDS (Q6.2 R149.1 R157.2), RF/RF_D/D_DCDC/DCP_D- (C209_5.1 C215_5.1 U38_5.12)
-7DDS: DDS (L23.2), DCDC_DDS (Q6.3 R156.2)
-7H: DCDC_Hall (Q21.2 R186.2 R187.1), RF/RF_H/H_DCDC/DCP_H- (C209_1.1 C215_1.1 U38_1.12)
-7Hall: Hall (L30.2), DCDC_Hall (Q21.3 R185.2)
-7i: DCDC_int (Q40.2 R224.2 R225.2), RF/RF_i/i_DCDC/DCP_i- (C209_2.1 C215_2.1 U38_2.12)
-7int: Integrator (L35.2), DCDC_int (Q40.3 R222.2)
-7SL: SlowChans (L70.2 L78.2 L87.2 L95.2), DCDC_Slow (Q57.3 R258.2)
-18Hall: Hall (L33.2), DCDC_Hall (Q14.3 R169.2)
-18int: Integrator (L38.2), DCDC_int (Q32.3 R208.2)
-18SL: SlowChans (L72.2 L81.2 L89.2 L97.2), DCDC_Slow (Q42.3 R228.2)
~{En}: RFCtl (U68.8 U68.13), DCDC_Hall (Q20.1), DCDC_int (R221.1), DCDC_DDS (Q5.1), DCDC_Slow (Q54.1)
BOOT_MODE0: main (J7.7), cyc_v_som_A (J14.A126)
BOOT_MODE1: main (J7.8), cyc_v_som_A (J14.A112)
CAN0_G: main (J2.3), U_can_phy (L13_1.1)
CAN0_H: main (J2.7), U_can_phy (L12_1.1)
CAN0_L: main (J2.2), U_can_phy (L12_1.4)
CAN0_RX: cyc_v_som_A (J14.A88), U_can_phy (R95_1.2)
CAN0_TX: cyc_v_som_A (J14.A90), U_can_phy (R97_1.2)
CAN1_G: main (J2.4), U_can_phy (L13_2.1)
CAN1_H: main (J2.8), U_can_phy (L12_2.1)
CAN1_L: main (J2.1), U_can_phy (L12_2.4)
CAN1_RX: cyc_v_som_A (J14.A104), U_can_phy (R95_2.2)
CAN1_TX: cyc_v_som_A (J14.A106), U_can_phy (R97_2.2)
Clock_hDCP-: RFCtl (U66.3), RF/RF_H/H_DCDC/DCP_H- (Q22_1.1 R233_1.2)
Clock_iDCP+: RFCtl (U64.3), RF/RF_i/i_DCDC/DCP_i+ (Q22_3.1 R233_3.2)
Clock_iDCP-: RFCtl (U64.6), RF/RF_i/i_DCDC/DCP_i- (Q22_2.1 R233_2.2)
DDS_CLK_N: DDS (C145.1 R174.1), Si5395_CLK_GEN (U21.23)
DDS_CLK_P: DDS (C144.1 R174.2), Si5395_CLK_GEN (U21.24)
EN_3V3: main (U6.6), RFCtl (J41.1)
ETH0_A_N: cyc_v_som_A (J14.A163), ethernet_1gbe_ext_magn (L11.3 U15.1)
ETH0_A_P: cyc_v_som_A (J14.A165), ethernet_1gbe_ext_magn (L11.2 U15.3)
ETH0_B_N: cyc_v_som_A (J14.A157), ethernet_1gbe_ext_magn (L11.6 U15.4)
ETH0_B_P: cyc_v_som_A (J14.A159), ethernet_1gbe_ext_magn (L11.5 U15.6)
ETH0_C_N: cyc_v_som_A (J14.A151), ethernet_1gbe_ext_magn (L11.9 U16.1)
ETH0_C_P: cyc_v_som_A (J14.A153), ethernet_1gbe_ext_magn (L11.8 U16.3)
ETH0_CTREF: cyc_v_som_A (J14.A155), ethernet_1gbe_ext_magn (5 pins)
ETH0_D_N: cyc_v_som_A (J14.A145), ethernet_1gbe_ext_magn (L11.12 U16.4)
ETH0_D_P: cyc_v_som_A (J14.A147), ethernet_1gbe_ext_magn (L11.11 U16.6)
ETH0_LED1: cyc_v_som_A (J14.A149), ethernet_1gbe_ext_magn (J18.9)
ETH0_LED2: cyc_v_som_A (J14.A161), ethernet_1gbe_ext_magn (J18.11)
ETH1_CTREF: cyc_v_som_A (J14.A154), ethernet_dual_100mbe_ext_magn (5 pins)
ETH1_LED1: cyc_v_som_A (J14.A160), ethernet_dual_100mbe_ext_magn (J17.9B)
ETH1_LED2: cyc_v_som_A (J14.A148), ethernet_dual_100mbe_ext_magn (J17.9A)
ETH1A_RX_N: cyc_v_som_A (J14.A156), ethernet_dual_100mbe_ext_magn (L6.6 U13.4)
ETH1A_RX_P: cyc_v_som_A (J14.A158), ethernet_dual_100mbe_ext_magn (L6.5 U13.6)
ETH1A_TX_N: cyc_v_som_A (J14.A162), ethernet_dual_100mbe_ext_magn (L6.3 U13.1)
ETH1A_TX_P: cyc_v_som_A (J14.A164), ethernet_dual_100mbe_ext_magn (L6.2 U13.3)
ETH1B_RX_N: cyc_v_som_A (J14.A144), ethernet_dual_100mbe_ext_magn (L6.12 U14.4)
ETH1B_RX_P: cyc_v_som_A (J14.A146), ethernet_dual_100mbe_ext_magn (L6.11 U14.6)
ETH1B_TX_N: cyc_v_som_A (J14.A150), ethernet_dual_100mbe_ext_magn (L6.9 U14.1)
ETH1B_TX_P: cyc_v_som_A (J14.A152), ethernet_dual_100mbe_ext_magn (L6.8 U14.3)
FCKO_N: main (C6.1), cyc_v_som_C (J14.C163)
FCKO_P: main (C5.1), cyc_v_som_C (J14.C161)
FPGA_CONFDONE: main (U6.1), cyc_v_som_A (J14.A130)
GPIO51: main (TP3.1), cyc_v_som_A (J14.A82)
GPIO52: main (TP5.1), cyc_v_som_A (J14.A84)
GPIO57: main (R22.1), cyc_v_som_A (J14.A98)
GPIO58: main (TP7.1), cyc_v_som_A (J14.A100)
GPIO63: main (TP9.1), cyc_v_som_A (J14.A92)
GPIO64: main (TP11.1), cyc_v_som_A (J14.A94)
GTP_REF0.IO_N: cyc_v_som_B (J14.B6), Si5395_CLK_GEN (C93.2)
GTP_REF0.IO_P: cyc_v_som_B (J14.B4), Si5395_CLK_GEN (C92.2)
GTP_REF1.IO_N: cyc_v_som_B (J14.B12), Si5395_CLK_GEN (C95.2)
GTP_REF1.IO_P: cyc_v_som_B (J14.B10), Si5395_CLK_GEN (C94.2)
GTP_REF2.IO_N: cyc_v_som_B (J14.B5), Si5395_CLK_GEN (C99.2)
GTP_REF2.IO_P: cyc_v_som_B (J14.B3), Si5395_CLK_GEN (C97.2)
HPS_PORn: main (R23.2 U7.1), cyc_v_som_A (J14.A132), sdcard_emmc (U11.M5)
HPS_RSTn: main (C14.1 J13.1 J13.2 R28.2), cyc_v_som_A (J14.A124), jtag (R40.1)
IN2_N: main (C6.2), Si5395_CLK_GEN (R111.1 U21.15)
IN2_P: main (C5.2), Si5395_CLK_GEN (R111.2 U21.14)
INT_SFP01: main (R5.1 U3.13), cyc_v_som_A (J14.A57)
INT_SFP23: main (R4.1 U2.13), cyc_v_som_A (J14.A55)
IO_AL1: cyc_v_som_A (J14.A15), Si5395_CLK_GEN (U21.12)
IO_AL2: cyc_v_som_A (J14.A17), Si5395_CLK_GEN (U21.18)
IO_AL3: cyc_v_som_A (J14.A19), Si5395_CLK_GEN (U21.16)
IO_AL4: cyc_v_som_A (J14.A21), Si5395_CLK_GEN (U21.19)
IO_AL5: cyc_v_som_A (J14.A25), Si5395_CLK_GEN (R105.2 U22.7)
IO_AL6: cyc_v_som_A (J14.A27), Si5395_CLK_GEN (U21.47)
IO_AL7: cyc_v_som_A (J14.A31), Si5395_CLK_GEN (R106.2 U22.8)
IO_AL8: cyc_v_som_A (J14.A33), Si5395_CLK_GEN (U22.2)
IO_AL9: cyc_v_som_A (J14.A37), Si5395_CLK_GEN (R122.1)
IO_AL10: cyc_v_som_A (J14.A39), Si5395_CLK_GEN (R121.1)
IO_AL11: main (6 pins), cyc_v_som_A (J14.A49)
IO_AL12: main (6 pins), cyc_v_som_A (J14.A51)
IO_AL15: main (R24.1), cyc_v_som_A (J14.A61)
IO_AL16: main (R21.1), cyc_v_som_A (J14.A63)
IO_AR11: cyc_v_som_A (J14.A46), Si5395_CLK_GEN (R125.2)
IO_BL1: cyc_v_som_B (J14.B7), Hall (R331.2)
IO_BL2: cyc_v_som_B (J14.B9), Hall (R332.2)
IO_BL3: cyc_v_som_B (J14.B57), Hall (R333.2)
IO_BL4: cyc_v_som_B (J14.B59), Hall (R334.2)
IO_BL5: cyc_v_som_B (J14.B75), Hall (R335.2)
IO_BL6: cyc_v_som_B (J14.B77), Hall (R336.2)
IO_BL7: cyc_v_som_B (J14.B81), Hall (R337.2)
IO_BL8: cyc_v_som_B (J14.B83), Hall (R338.2)
IO_BL9: cyc_v_som_B (J14.B87), Hall (R339.2)
IO_BL10: cyc_v_som_B (J14.B89), Hall (R370.2)
IO_BL11: cyc_v_som_B (J14.B91), Hall (R371.2)
IO_BL12: cyc_v_som_B (J14.B93), Hall (R372.2)
IO_BL13: cyc_v_som_B (J14.B97), Hall (R378.2)
IO_BL14: cyc_v_som_B (J14.B99), Hall (R379.2)
IO_BL15: cyc_v_som_B (J14.B101), Hall (R380.2)
IO_BL16: cyc_v_som_B (J14.B103), Hall (R381.2)
IO_BL17: cyc_v_som_B (J14.B107), Integrator (R419.1)
IO_BL18: cyc_v_som_B (J14.B109), Integrator (R420.1)
IO_BL19: cyc_v_som_B (J14.B111), Integrator (R421.1)
IO_BL20: cyc_v_som_B (J14.B113), Integrator (R422.1)
IO_BL21: cyc_v_som_B (J14.B117), Integrator (R423.1)
IO_BL22: cyc_v_som_B (J14.B119), Integrator (R424.1)
IO_BL23: cyc_v_som_B (J14.B123), Integrator (R425.1)
IO_BL24: cyc_v_som_B (J14.B125), Integrator (R426.1)
IO_BL25: cyc_v_som_B (J14.B129), Integrator (R427.1)
IO_BL26: cyc_v_som_B (J14.B131), Integrator (R428.1)
IO_BL27: cyc_v_som_B (J14.B133), Integrator (R429.1)
IO_BL28: cyc_v_som_B (J14.B135), Integrator (R430.1)
IO_BL29: cyc_v_som_B (J14.B139), Integrator (R431.1)
IO_BL30: cyc_v_som_B (J14.B141), Integrator (R432.1)
IO_BL31: cyc_v_som_B (J14.B145), Integrator (R433.1)
IO_BL32: cyc_v_som_B (J14.B147), Integrator (R434.1)
IO_BL33: cyc_v_som_B (J14.B151), Integrator (R436.1)
IO_BL34: cyc_v_som_B (J14.B153), Integrator (R439.1)
IO_BL35: cyc_v_som_B (J14.B157), Integrator (R440.1)
IO_BL36: cyc_v_som_B (J14.B159), Integrator (R528.1)
IO_BR23: cyc_v_som_B (J14.B130), SlowChans (R153.2)
IO_BR24: cyc_v_som_B (J14.B132), SlowChans (R209.2)
IO_BR25: cyc_v_som_B (J14.B136), SlowChans (R256.2)
IO_BR26: cyc_v_som_B (J14.B138), SlowChans (R445.2)
IO_BR27: cyc_v_som_B (J14.B142), SlowChans (R182.2)
IO_BR28: cyc_v_som_B (J14.B144), SlowChans (R220.2)
IO_BR29: cyc_v_som_B (J14.B148), SlowChans (R437.2)
IO_BR30: cyc_v_som_B (J14.B150), SlowChans (R446.2)
IO_BR31: cyc_v_som_B (J14.B154), SlowChans (R183.2)
IO_BR32: cyc_v_som_B (J14.B156), SlowChans (R238.2)
IO_BR33: cyc_v_som_B (J14.B160), SlowChans (R438.2)
IO_BR34: cyc_v_som_B (J14.B162), SlowChans (R447.2)
IO_BR35: cyc_v_som_B (J14.B164), SlowChans (R456.2)
IO_BR36: cyc_v_som_B (J14.B166), SlowChans (R461.2)
IO_CL1: cyc_v_som_C (J14.C63), SlowChans (R517.2)
IO_CL2: cyc_v_som_C (J14.C65), SlowChans (R521.2)
IO_CL3: cyc_v_som_C (J14.C69), SlowChans (R351.2)
IO_CL4: cyc_v_som_C (J14.C71), SlowChans (R356.2)
IO_CL5: cyc_v_som_C (J14.C75), SlowChans (R361.2)
IO_CL6: cyc_v_som_C (J14.C77), SlowChans (R366.2)
IO_CL7: cyc_v_som_C (J14.C79), SlowChans (R352.2)
IO_CL8: cyc_v_som_C (J14.C81), SlowChans (R357.2)
IO_CL9: cyc_v_som_C (J14.C85), SlowChans (R362.2)
IO_CL10: cyc_v_som_C (J14.C87), SlowChans (R367.2)
IO_CL11: cyc_v_som_C (J14.C89), SlowChans (R353.2)
IO_CL12: cyc_v_som_C (J14.C91), SlowChans (R358.2)
IO_CL13: cyc_v_som_C (J14.C95), SlowChans (R363.2)
IO_CL14: cyc_v_som_C (J14.C97), SlowChans (R368.2)
IO_CL21: cyc_v_som_C (J14.C115), RFCtl (R453.2)
IO_CL27: main (R9.2), cyc_v_som_C (J14.C129)
IO_CL28: main (R11.2), cyc_v_som_C (J14.C131)
IO_CL29: main (R12.2), cyc_v_som_C (J14.C135)
IO_CL30: main (R15.2), cyc_v_som_C (J14.C137)
IO_CLK4P_AL25: cyc_v_som_A (J14.A85), Si5395_CLK_GEN (R107.2)
IO_CR1: cyc_v_som_C (J14.C66), SlowChans (R466.2)
IO_CR2: cyc_v_som_C (J14.C68), SlowChans (R471.2)
IO_CR3: cyc_v_som_C (J14.C72), SlowChans (R457.2)
IO_CR4: cyc_v_som_C (J14.C74), SlowChans (R462.1)
IO_CR5: cyc_v_som_C (J14.C78), SlowChans (R467.2)
IO_CR6: cyc_v_som_C (J14.C80), SlowChans (R472.2)
IO_CR7: cyc_v_som_C (J14.C82), SlowChans (R458.2)
IO_CR8: cyc_v_som_C (J14.C84), SlowChans (R463.2)
IO_CR9: cyc_v_som_C (J14.C88), SlowChans (R468.2)
IO_CR10: cyc_v_som_C (J14.C90), SlowChans (R473.2)
IO_CR11: cyc_v_som_C (J14.C92), SlowChans (R480.2)
IO_CR12: cyc_v_som_C (J14.C94), SlowChans (R483.2)
IO_CR13: cyc_v_som_C (J14.C98), SlowChans (R488.2)
IO_CR14: cyc_v_som_C (J14.C100), SlowChans (R493.2)
IO_CR15: cyc_v_som_C (J14.C102), SlowChans (R481.2)
IO_CR16: cyc_v_som_C (J14.C104), SlowChans (R486.2)
IO_CR17: cyc_v_som_C (J14.C108), SlowChans (R491.2)
IO_CR18: cyc_v_som_C (J14.C110), SlowChans (R496.2)
IO_CR19: cyc_v_som_C (J14.C112), SlowChans (R482.2)
IO_CR20: cyc_v_som_C (J14.C114), SlowChans (R487.2)
IO_CR21: main (P1.17), cyc_v_som_C (J14.C118), SlowChans (R492.2)
IO_CR22: main (P1.19), cyc_v_som_C (J14.C120), SlowChans (R497.2)
IO_CR23: main (P1.23), cyc_v_som_C (J14.C122), SlowChans (R504.2)
IO_CR24: main (P1.25), cyc_v_som_C (J14.C124), SlowChans (R505.2)
IO_CR25: main (P1.27), cyc_v_som_C (J14.C128), SlowChans (R510.2)
IO_CR26: main (P1.29), cyc_v_som_C (J14.C130), SlowChans (R515.2)
IO_CR27: main (P1.33), cyc_v_som_C (J14.C132), SlowChans (R506.2)
IO_CR28: main (P1.35), cyc_v_som_C (J14.C134), SlowChans (R511.2)
IO_CR29: main (P1.37), cyc_v_som_C (J14.C138), SlowChans (R516.2)
IO_CR30: main (P1.39), cyc_v_som_C (J14.C140), SlowChans (R520.2)
IO_CR31: main (P1.43), cyc_v_som_C (J14.C142), SlowChans (R507.2)
IO_CR32: main (P1.45), cyc_v_som_C (J14.C144), SlowChans (R512.2)
IO_CR33: cyc_v_som_C (J14.C148), Si5395_CLK_GEN (C88.2)
IO_CR34: cyc_v_som_C (J14.C150), Si5395_CLK_GEN (C89.2)
IO_CR35: main (P1.47), cyc_v_som_C (J14.C154)
IO_CR36: main (P1.49), cyc_v_som_C (J14.C156)
IO_CR37: main (P1.53), cyc_v_som_C (J14.C160)
IO_CR38: main (P1.55), cyc_v_som_C (J14.C162)
IO_CR39: main (P1.57), cyc_v_som_C (J14.C164)
IO_CR40: main (P1.59), cyc_v_som_C (J14.C166)
JTAG_TCK: cyc_v_som_A (J14.A123), jtag (R42.1)
JTAG_TDI: cyc_v_som_A (J14.A117), jtag (R44.1)
JTAG_TDO: cyc_v_som_A (J14.A121), jtag (R47.1)
JTAG_TMS: cyc_v_som_A (J14.A119), jtag (R46.1)
MGT_RX8.IO_N: main (P1.5), cyc_v_som_C (J14.C20)
MGT_RX8.IO_P: main (P1.3), cyc_v_som_C (J14.C16)
MGT_TX6_N: main (C9.2), cyc_v_som_B (J14.B63)
MGT_TX6_P: main (C8.2), cyc_v_som_B (J14.B65)
MGT_TX8.IO_N: main (P1.6), cyc_v_som_C (J14.C17)
MGT_TX8.IO_P: main (P1.4), cyc_v_som_C (J14.C13)
ModDef_SFP0: main (U3.5), U_SFPplusConn_0 (J22_1.6 R100_1.8)
ModDef_SFP1: main (U3.10), U_SFPplusConn_1 (J22_2.6 R100_2.8)
ModDef_SFP2: main (U2.5), U_SFPplusConn_2 (J22_3.6 R100_3.8)
ModDef_SFP3: main (U2.10), U_SFPplusConn_3 (J22_4.6 R100_4.8)
NetC114_1: Si5395_CLK_GEN (R103.2), power_REG104GA_3V3 (C114.1 C116.2 U25.2)
NetC120_1: Si5395_CLK_GEN (R101.2), power_REG104GA_1V8 (5 pins)
NetQ22_4_1: RF/RF_D/D_DCDC/DCP_D+ (Q22_4.1 R233_4.2), RF/RF_D/D_DCDC/DCP_D- (Q22_5.1 R233_5.2)
NetQ22_6_1: RF/RF_S/S_DCDC/DCP_S+ (Q22_6.1 R233_6.2), RF/RF_S/S_DCDC/DCP_S- (Q22_7.1 R233_7.2)
PWR_EN: main (C12.2), cyc_v_som_A (J14.A10)
PWR_GOOD: main (U6.3), cyc_v_som_A (J14.A12)
QBR_N: main (P1.12 TP1.1), cyc_v_som_A (J14.A45)
QBR_P: main (P1.14 TP2.1), cyc_v_som_A (J14.A43)
RateSel0_SFP0: main (U4.4), U_SFPplusConn_0 (J22_1.7 R100_1.7)
RateSel0_SFP1: main (U4.6), U_SFPplusConn_1 (J22_2.7 R100_2.7)
RateSel0_SFP2: main (U4.9), U_SFPplusConn_2 (J22_3.7 R100_3.7)
RateSel0_SFP3: main (U4.11), U_SFPplusConn_3 (J22_4.7 R100_4.7)
RateSel1_SFP0: main (U4.5), U_SFPplusConn_0 (J22_1.9 R100_1.5)
RateSel1_SFP1: main (U4.7), U_SFPplusConn_1 (J22_2.9 R100_2.5)
RateSel1_SFP2: main (U4.10), U_SFPplusConn_2 (J22_3.9 R100_3.5)
RateSel1_SFP3: main (U4.12), U_SFPplusConn_3 (J22_4.9 R100_4.5)
RxLos_SFP0: main (U3.4), U_SFPplusConn_0 (J22_1.8 R100_1.6)
RxLos_SFP1: main (U3.9), U_SFPplusConn_1 (J22_2.8 R100_2.6)
RxLos_SFP2: main (U2.4), U_SFPplusConn_2 (J22_3.8 R100_3.6)
RxLos_SFP3: main (U2.9), U_SFPplusConn_3 (J22_4.8 R100_4.6)
SDIO_CLK: cyc_v_som_A (J14.A91), sdcard_emmc (U12.9)
SDIO_CMD: cyc_v_som_A (J14.A93), sdcard_emmc (U12.4)
SDIO_D0: cyc_v_som_A (J14.A95), sdcard_emmc (U12.6)
SDIO_D1: cyc_v_som_A (J14.A97), sdcard_emmc (U12.7)
SDIO_D2: cyc_v_som_A (J14.A101), sdcard_emmc (U12.1)
SDIO_D3: cyc_v_som_A (J14.A103), sdcard_emmc (U12.3)
SDIO_SEL: main (J7.5), sdcard_emmc (R70.1 U12.24)
SFP_I2C_0.SCL: main (U1.6), U_SFPplusConn_0 (J22_1.5 R99_1.5)
SFP_I2C_0.SDA: main (U1.5), U_SFPplusConn_0 (J22_1.4 R99_1.6)
SFP_I2C_1.SCL: main (U1.9), U_SFPplusConn_1 (J22_2.5 R99_2.5)
SFP_I2C_1.SDA: main (U1.8), U_SFPplusConn_1 (J22_2.4 R99_2.6)
SFP_I2C_2.SCL: main (U1.13), U_SFPplusConn_2 (J22_3.5 R99_3.5)
SFP_I2C_2.SDA: main (U1.12), U_SFPplusConn_2 (J22_3.4 R99_3.6)
SFP_I2C_3.SCL: main (U1.16), U_SFPplusConn_3 (J22_4.5 R99_4.5)
SFP_I2C_3.SDA: main (U1.15), U_SFPplusConn_3 (J22_4.4 R99_4.6)
SFP_IO_0.TxDis: main (U3.6), U_SFPplusConn_0 (J22_1.3 R99_1.7)
SFP_IO_0.TxFault: main (U3.7), U_SFPplusConn_0 (J22_1.2 R99_1.8)
SFP_IO_1.TxDis: main (U3.11), U_SFPplusConn_1 (J22_2.3 R99_2.7)
SFP_IO_1.TxFault: main (U3.12), U_SFPplusConn_1 (J22_2.2 R99_2.8)
SFP_IO_2.TxDis: main (U2.6), U_SFPplusConn_2 (J22_3.3 R99_3.7)
SFP_IO_2.TxFault: main (U2.7), U_SFPplusConn_2 (J22_3.2 R99_3.8)
SFP_IO_3.TxDis: main (U2.11), U_SFPplusConn_3 (J22_4.3 R99_4.7)
SFP_IO_3.TxFault: main (U2.12), U_SFPplusConn_3 (J22_4.2 R99_4.8)
SFP_RX_0.IO_N: cyc_v_som_B (J14.B20), U_SFPplusConn_0 (J22_1.13)
SFP_RX_0.IO_P: cyc_v_som_B (J14.B16), U_SFPplusConn_0 (J22_1.12)
SFP_RX_1.IO_N: cyc_v_som_B (J14.B44), U_SFPplusConn_1 (J22_2.13)
SFP_RX_1.IO_P: cyc_v_som_B (J14.B40), U_SFPplusConn_1 (J22_2.12)
SFP_RX_2.IO_N: cyc_v_som_B (J14.B50), U_SFPplusConn_2 (J22_3.13)
SFP_RX_2.IO_P: cyc_v_som_B (J14.B48), U_SFPplusConn_2 (J22_3.12)
SFP_RX_3.IO_N: cyc_v_som_B (J14.B56), U_SFPplusConn_3 (J22_4.13)
SFP_RX_3.IO_P: cyc_v_som_B (J14.B54), U_SFPplusConn_3 (J22_4.12)
SFP_TX_0.IO_N: cyc_v_som_B (J14.B17), U_SFPplusConn_0 (J22_1.19)
SFP_TX_0.IO_P: cyc_v_som_B (J14.B13), U_SFPplusConn_0 (J22_1.18)
SFP_TX_1.IO_N: cyc_v_som_B (J14.B41), U_SFPplusConn_1 (J22_2.19)
SFP_TX_1.IO_P: cyc_v_som_B (J14.B37), U_SFPplusConn_1 (J22_2.18)
SFP_TX_2.IO_N: cyc_v_som_B (J14.B47), U_SFPplusConn_2 (J22_3.19)
SFP_TX_2.IO_P: cyc_v_som_B (J14.B45), U_SFPplusConn_2 (J22_3.18)
SFP_TX_3.IO_N: cyc_v_som_B (J14.B53), U_SFPplusConn_3 (J22_4.19)
SFP_TX_3.IO_P: cyc_v_som_B (J14.B51), U_SFPplusConn_3 (J22_4.18)
UART_RX: cyc_v_som_A (J14.A105), uart_adm3222 (R55.1)
UART_TX: cyc_v_som_A (J14.A107), uart_adm3222 (R53.1)